# Altium schematic sheet Схема алгоритма работы.SchDoc
size 840 x 594 mm; Address1: Address1; Address2: Address2; Address3: Address3; Address4: Address4; SheetNumber: 1; Scale: 1:1; Разраб.: Иванов; Обозначение документа: АБВГ.123456.001 Э3; Пров.: Петров; Утв.: Сидоров; Наименование организации: ОАО "Концерн "МПО-Гидроприбор"; Перв. применение: АБВГ.123456.000; Наименование изделия 1: Плата; Наименование изделия 2: Схема электрическая; Наименование изделия 3: принципиальная; Нач. отд.: Нач. отд.; Фамилия нач. отд.: Сидоров
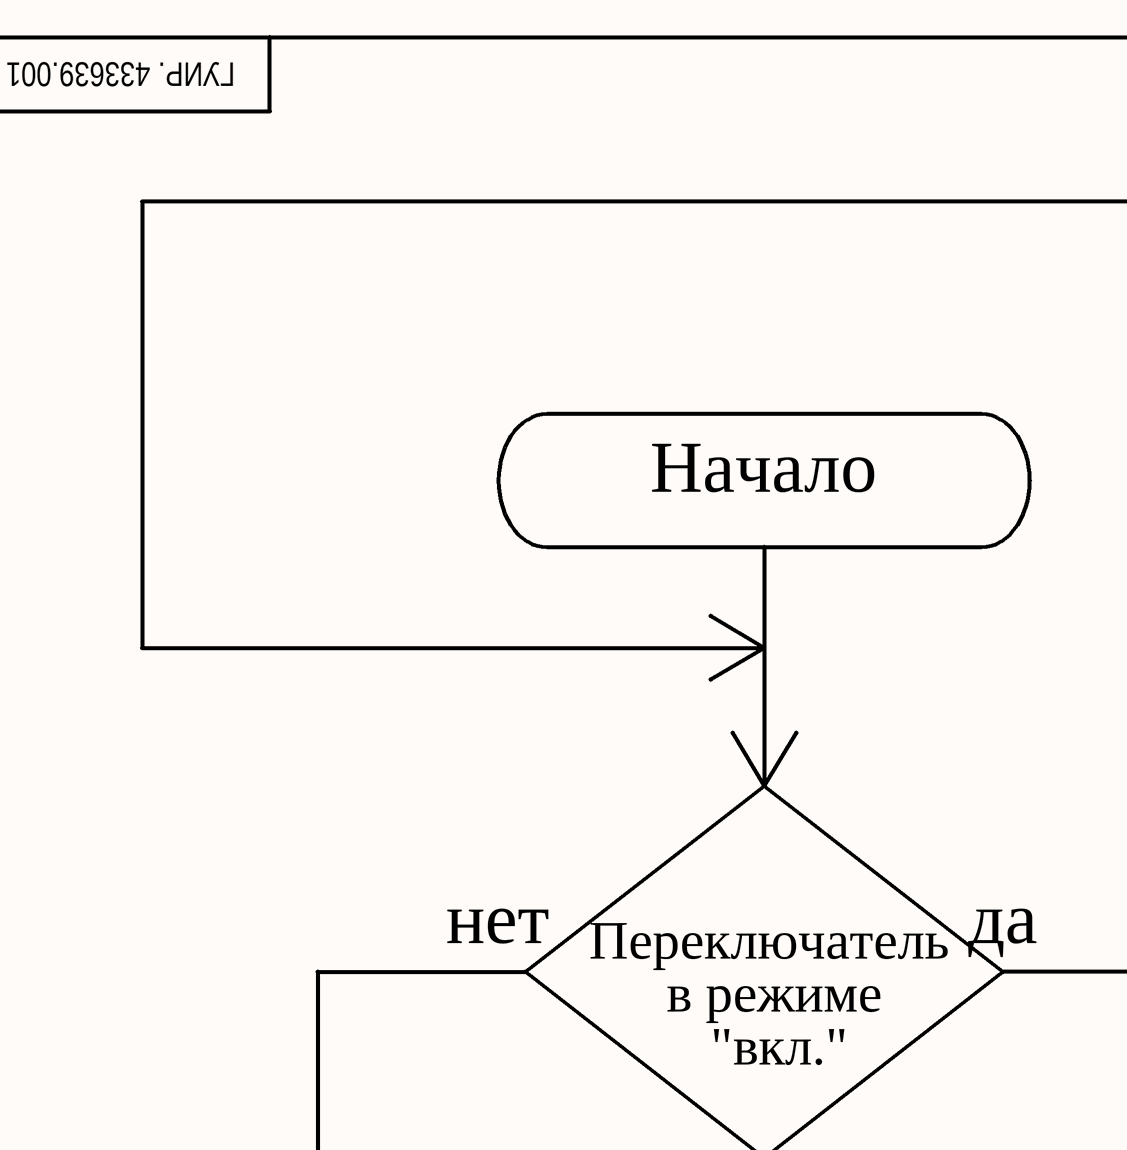
[diagram p0: Схема алгоритма работы.SchDoc, top left]
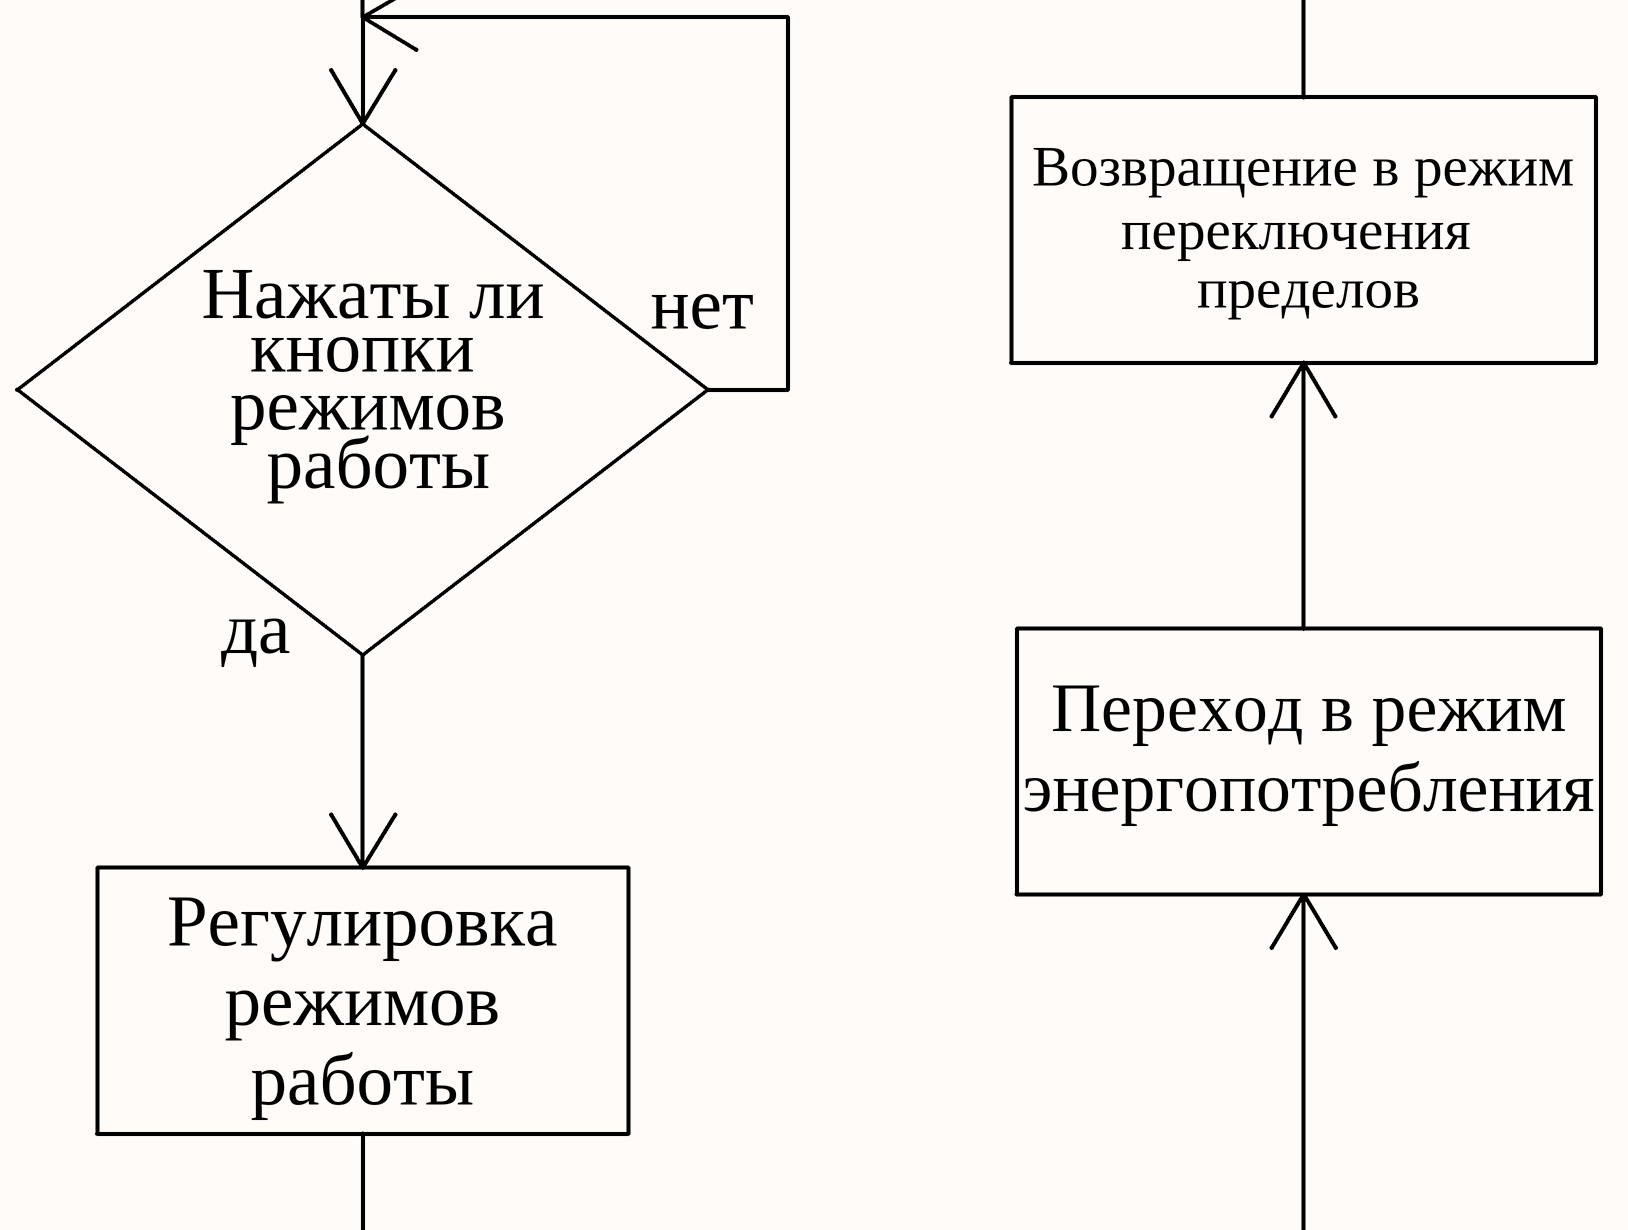
[diagram p1: Схема алгоритма работы.SchDoc, top middle]
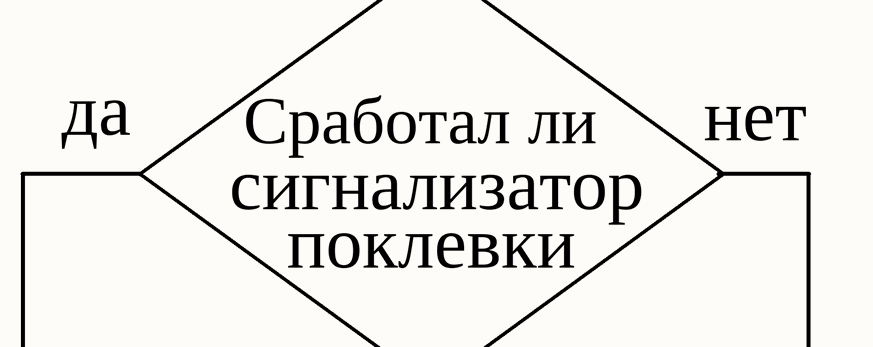
[diagram p2: Схема алгоритма работы.SchDoc, top right]
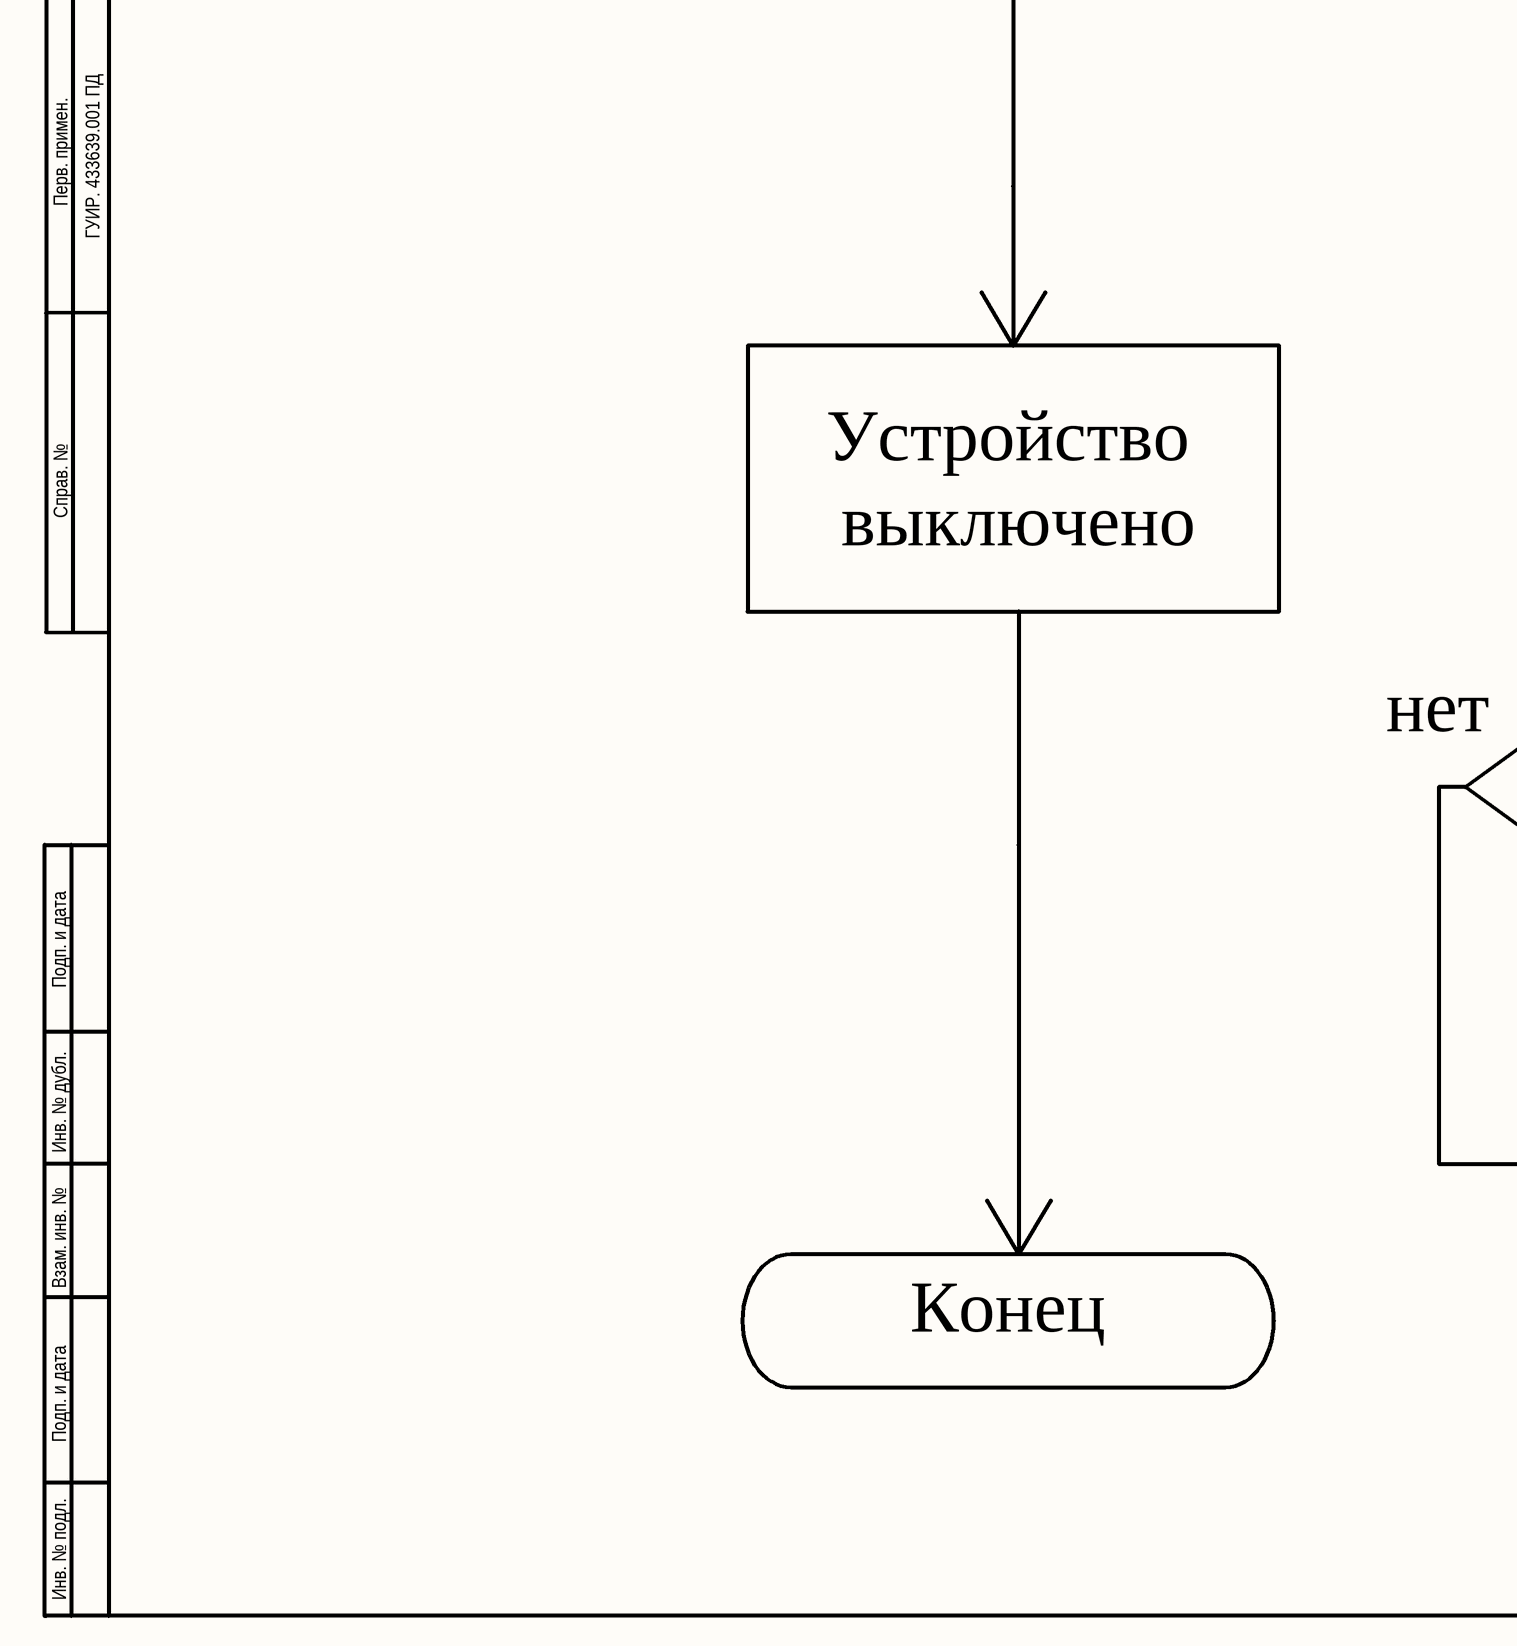
[diagram p3: Схема алгоритма работы.SchDoc, bottom left]
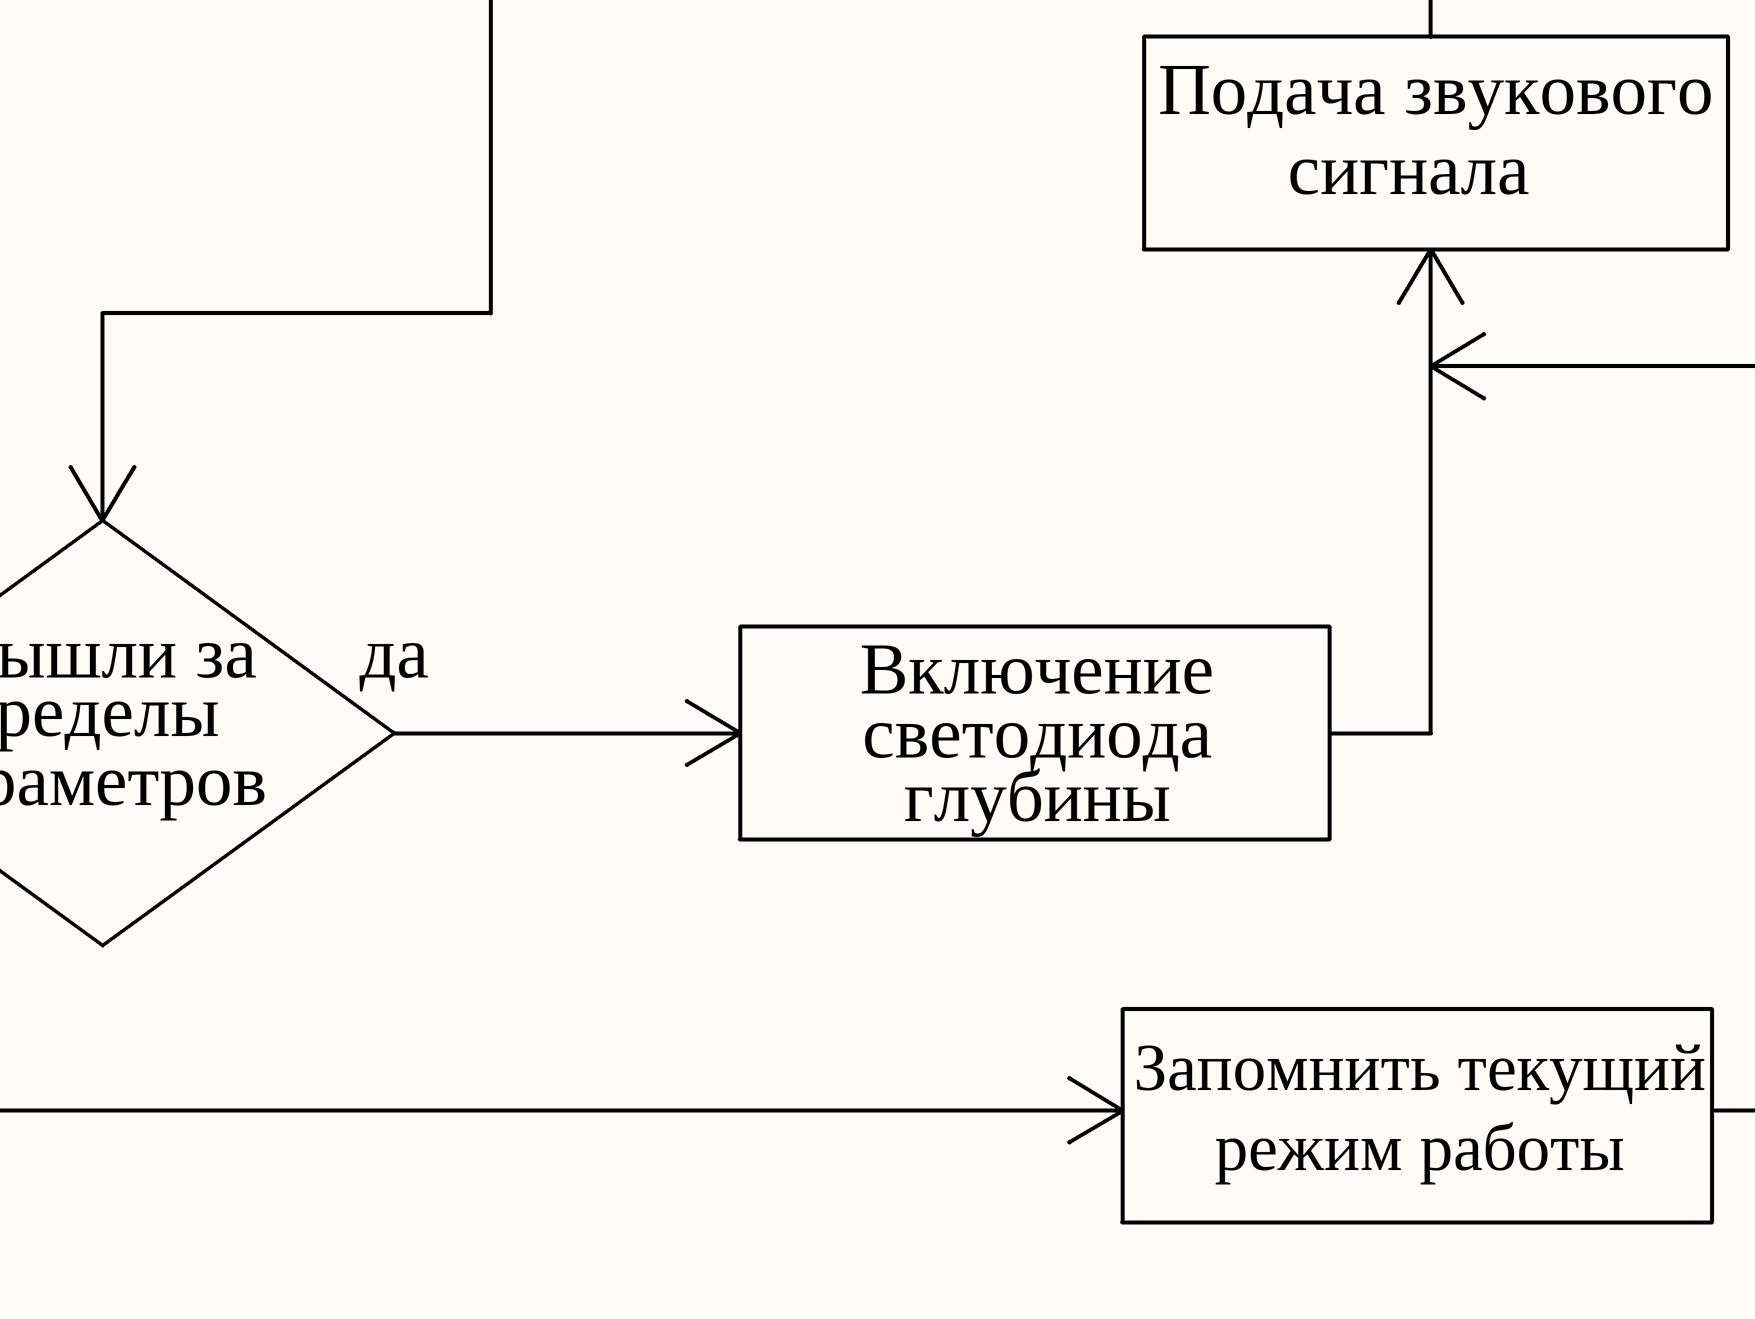
[diagram p4: Схема алгоритма работы.SchDoc, bottom middle]
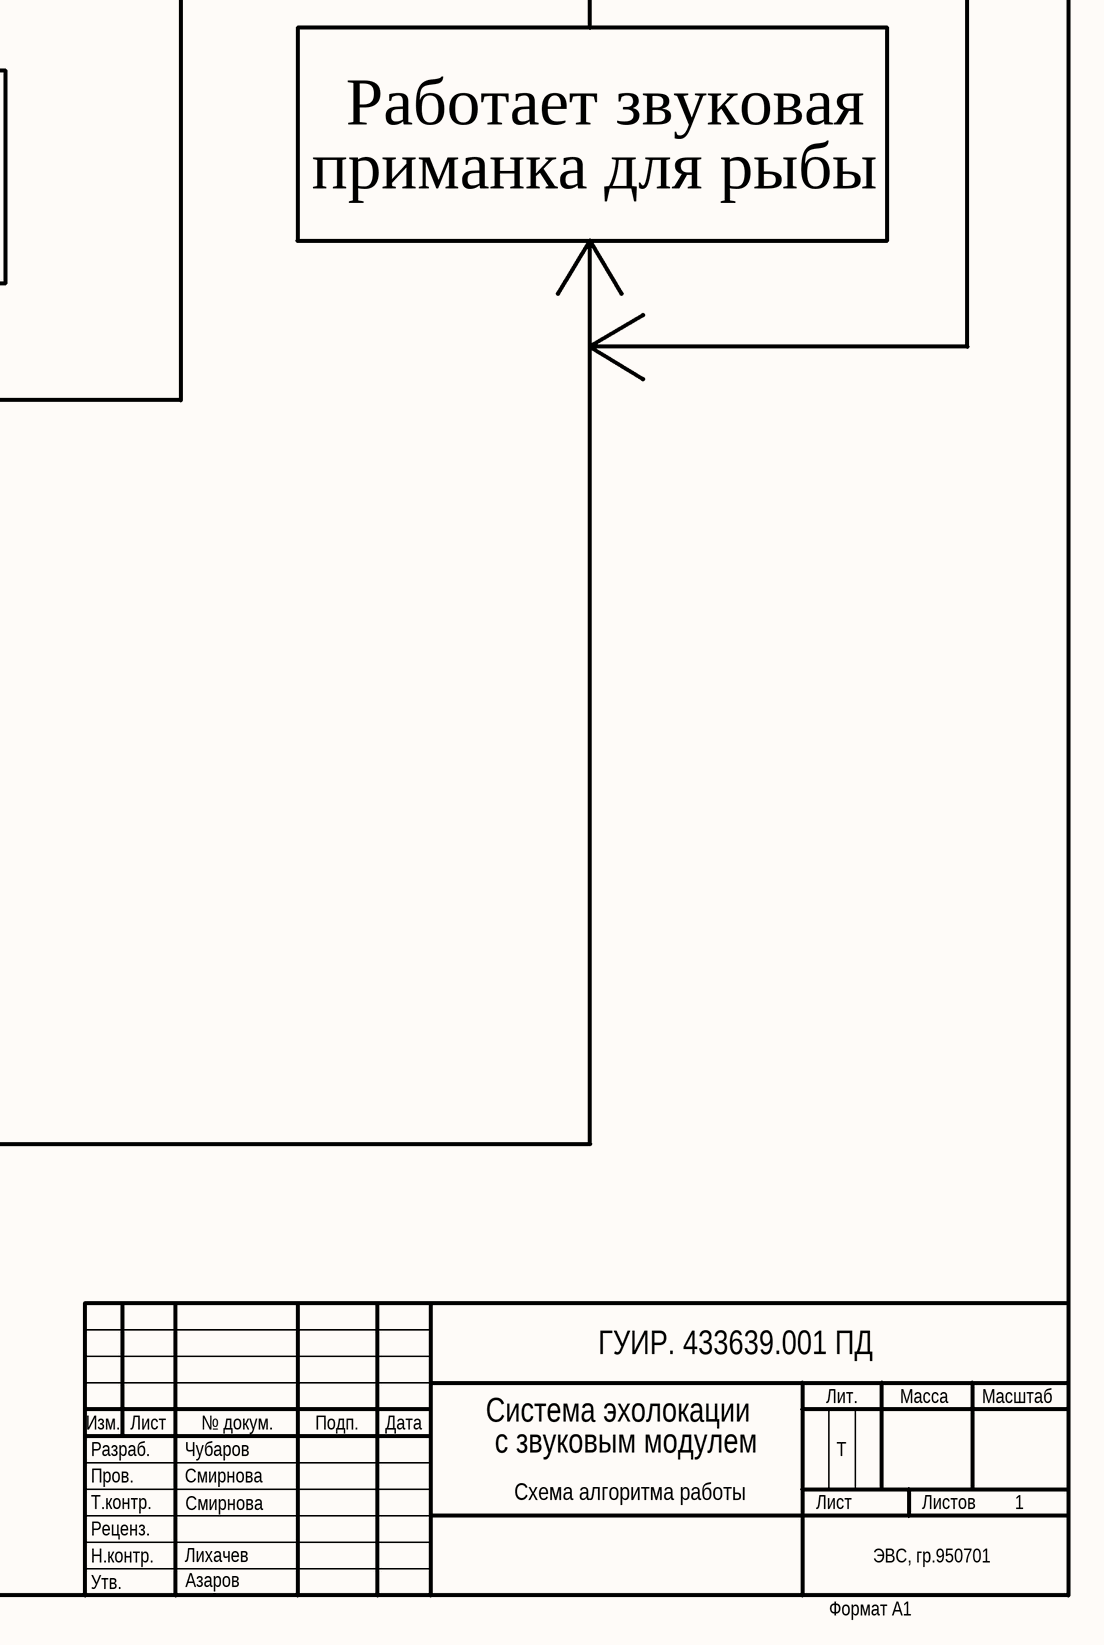
[diagram p5: Схема алгоритма работы.SchDoc, bottom right]

## Notes on the sheet
- ГУИР. 433639.001 ПД
- Начало
- Возвращение в режим
- переключения
- Нажаты ли
- нет
- пределов
- кнопки
- режимов
- работы
- Переключатель
- да
- в режиме
- "вкл."
- Переход в режим
- энергопотребления
- Сработал ли
- сигнализатор
- Регулировка
- поклевки
- Работает звуковая
- Подача звукового
- приманка для рыбы
- Перв. примен.
- сигнала
- Устройство
- Справ. №
- выключено
- Вышли за
- Включение
- пределы
- светодиода
- параметров
- глубины
- Подп. и дата
- Запомнить текущий
- Инв. № дубл.
- режим работы
- Взам. инв. №
- Конец
- Разраб.
- Изм.
- Лист
- Чубаров
- № докум.
- Подп.
- Дата
- Система эхолокации
- с звуковым модулем
- T
- Лит.
- Масса
- Масштаб
- Пров.
- Т.контр.
- Смирнова
- Схема алгоритма работы
- Листов
- 1
- Инв. № подл.
- Утв.
- Н.контр.
- Реценз.
- Лихачев
- Азаров
- ЭВС, гр.950701
- Формат А1